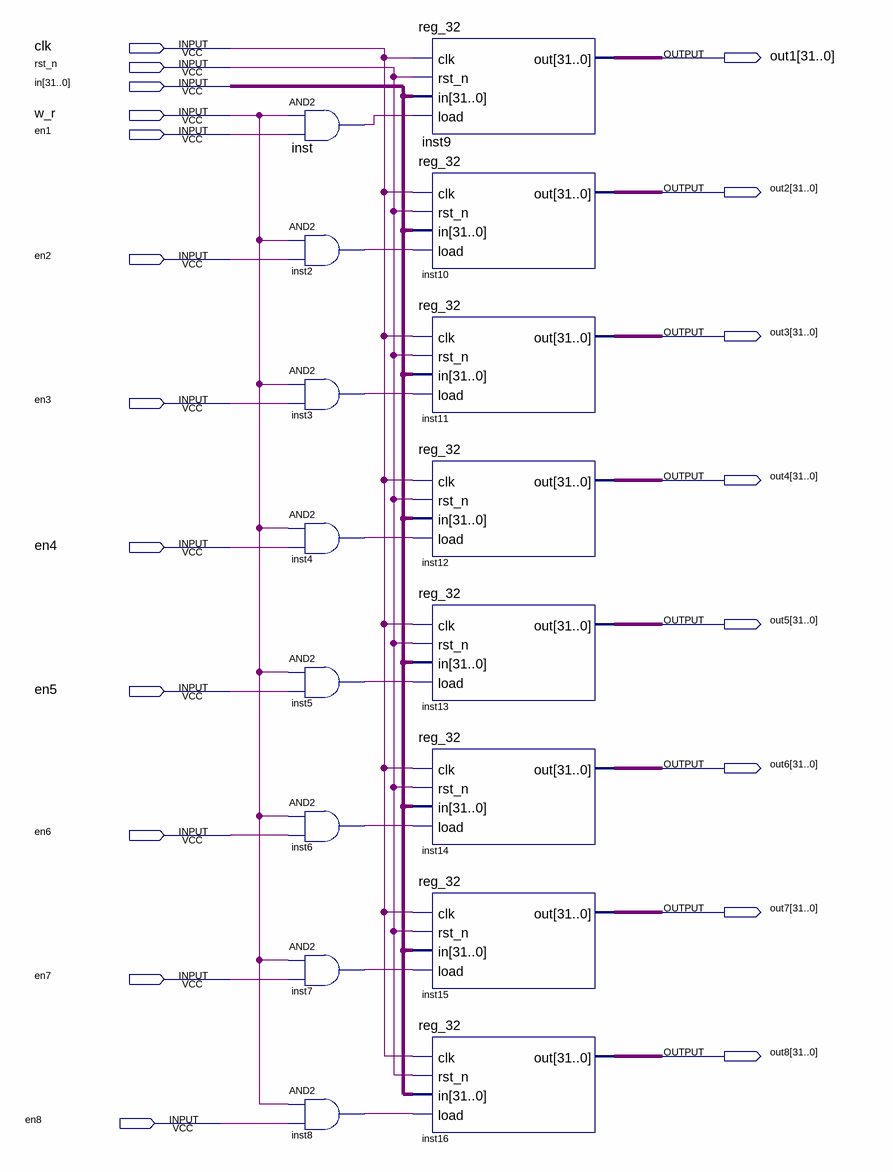
[diagram p0: schematic sheet]
// Quartus schematic regfile.bdf as structural Verilog: 16 symbols, 20 pins
module regfile (
  input  clk,
  input  rst_n,
  input  [31:0] in,
  input  w_r,
  input  en1,
  input  en2,
  input  en3,
  input  en4,
  input  en5,
  input  en6,
  input  en7,
  input  en8,
  output [31:0] out1,
  output [31:0] out2,
  output [31:0] out3,
  output [31:0] out4,
  output [31:0] out5,
  output [31:0] out6,
  output [31:0] out7,
  output [31:0] out8
);

  wire inst2_out, inst3_out, inst4_out, inst5_out, inst6_out, inst7_out, inst8_out, inst_out;

  and inst (inst_out, w_r, en1);
  and inst2 (inst2_out, w_r, en2);
  and inst3 (inst3_out, w_r, en3);
  and inst4 (inst4_out, w_r, en4);
  and inst5 (inst5_out, w_r, en5);
  and inst6 (inst6_out, w_r, en6);
  and inst7 (inst7_out, w_r, en7);
  and inst8 (inst8_out, w_r, en8);
  reg_32 inst9 (.clk(clk), .rst_n(rst_n), .in(in), .load(inst_out), .out(out1));
  reg_32 inst10 (.clk(clk), .rst_n(rst_n), .in(in), .load(inst2_out), .out(out2));
  reg_32 inst11 (.clk(clk), .rst_n(rst_n), .in(in), .load(inst3_out), .out(out3));
  reg_32 inst12 (.clk(clk), .rst_n(rst_n), .in(in), .load(inst4_out), .out(out4));
  reg_32 inst13 (.clk(clk), .rst_n(rst_n), .in(in), .load(inst5_out), .out(out5));
  reg_32 inst14 (.clk(clk), .rst_n(rst_n), .in(in), .load(inst6_out), .out(out6));
  reg_32 inst15 (.clk(clk), .rst_n(rst_n), .in(in), .load(inst7_out), .out(out7));
  reg_32 inst16 (.clk(clk), .rst_n(rst_n), .in(in), .load(inst8_out), .out(out8));
endmodule
